# EAGLE schematic 00B-060 (EAGLE 6.3)
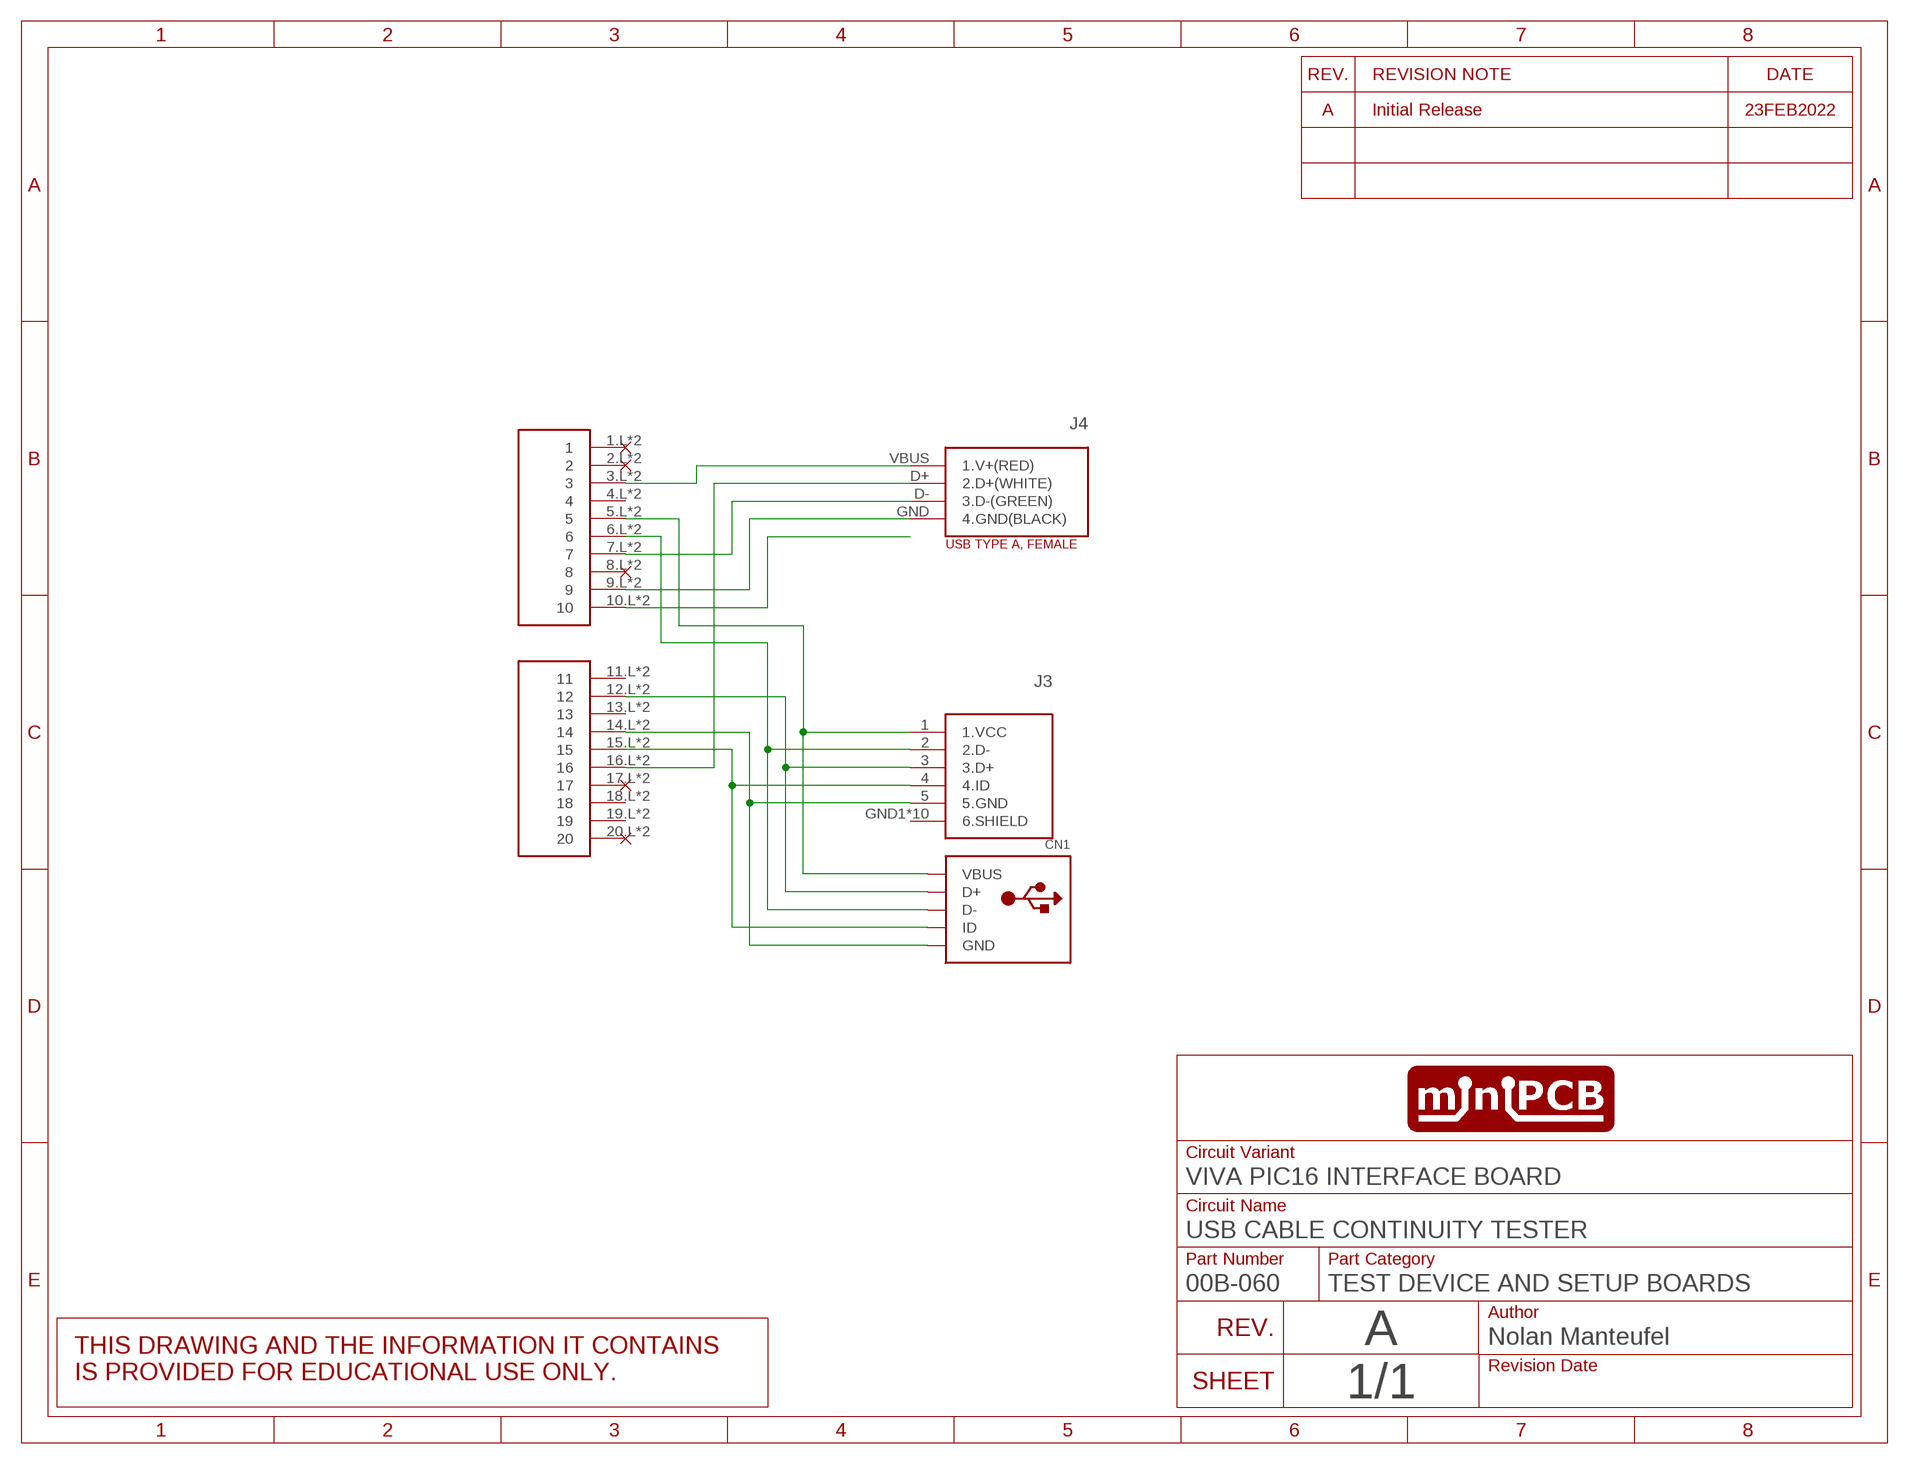
[diagram p0: schematic, sheet 1]
SHEET1 (SCHEMATIC): BOARD_NO: 00B-060-A; CIRCUIT_CATEGORY: TEST DEVICE AND SETUP BOARDS; CIRCUIT_NAME: USB CABLE CONTINUITY TESTER; REVISION: A

## Parts
CN1  USBMINIB  [USB-MINIB]
J3  USB  [USB_MICRO]
J4  USB_A_FEMALE  [TYPE-A-FEMALE]
U$1  VIVA_PIC16SHIELD  [VIVA_SHIELD]

## Nets
N$5: J4.VBUS(1.V+(RED)) U$1.3.L U$1.3.R
N$6: J4.D+(2.D+(WHITE)) U$1.16.L U$1.16.R
N$7: J4.D-(3.D-(GREEN)) U$1.7.L U$1.7.R
N$8: J4.GND(4.GND(BLACK)) U$1.9.L U$1.9.R
N$9: U$1.10.L U$1.10.R
N$10: CN1.VBUS J3.1(1.VCC) U$1.5.L U$1.5.R
N$11: CN1.D+ J3.3(3.D+) U$1.12.L U$1.12.R
N$12: CN1.D- J3.2(2.D-) U$1.6.L U$1.6.R
N$13: CN1.GND J3.5(5.GND) U$1.14.L U$1.14.R
N$14: CN1.ID J3.4(4.ID) U$1.15.L U$1.15.R
Unconnected: J3.GND1(6.SHIELD) J3.GND2(6.SHIELD) J3.GND3(6.SHIELD) J3.GND4(6.SHIELD) J3.GND5(6.SHIELD) J3.GND6(6.SHIELD) J3.GND7(6.SHIELD) J3.GND8(6.SHIELD) J3.GND9(6.SHIELD) J3.GND10(6.SHIELD) U$1.1.L U$1.1.R U$1.2.L U$1.2.R U$1.4.L U$1.4.R U$1.8.L U$1.8.R U$1.11.L U$1.11.R U$1.13.L U$1.13.R U$1.17.L U$1.17.R U$1.18.L U$1.18.R U$1.19.L U$1.19.R U$1.20.L U$1.20.R

## Notes on the sheet
- 23FEB2022

## Library data of the parts
CN1 = adafruit:USB: USB Connectors USBMINIB - Surface Mount Female Mini-B USB Connector 4UConnector: 06564 By microbuilder.eu Thru-hole RA Female Mini-B USB Connector 4UConnector: 18732 By ladyada.net
J3 = utsa:USB
J4 = utsa:USB_A_FEMALE
U$1 = utsa:VIVA_PIC16